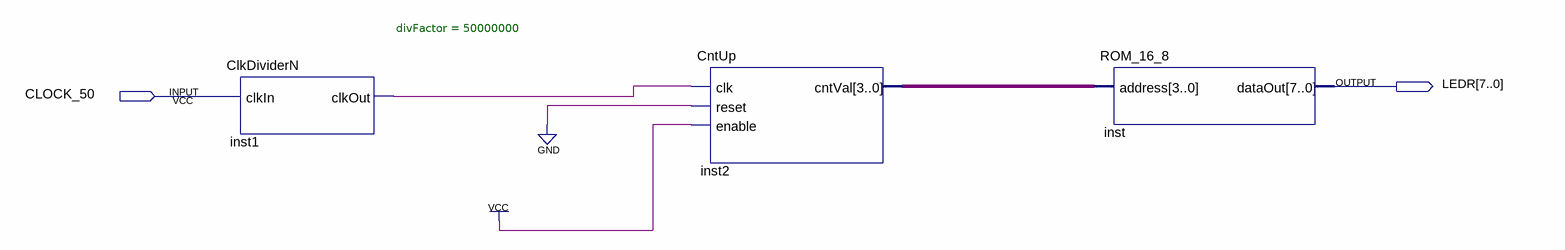
[diagram p0: schematic sheet]
// Quartus schematic ROM_Demo.bdf as structural Verilog: 3 symbols, 2 pins
module ROM_Demo (
  input  CLOCK_50,
  output [7:0] LEDR
);

  wire inst1_clkout;
  wire [3:0] inst2_cntval;

  ClkDividerN #(.divFactor(50000000)) inst1 (.clkIn(CLOCK_50), .clkOut(inst1_clkout));
  CntUp inst2 (.clk(inst1_clkout), .reset(1'b0), .enable(1'b1), .cntVal(inst2_cntval));
  ROM_16_8 inst (.address(inst2_cntval), .dataOut(LEDR));
endmodule
